# Altium project THREE_PHASE_METER.PrjPCB
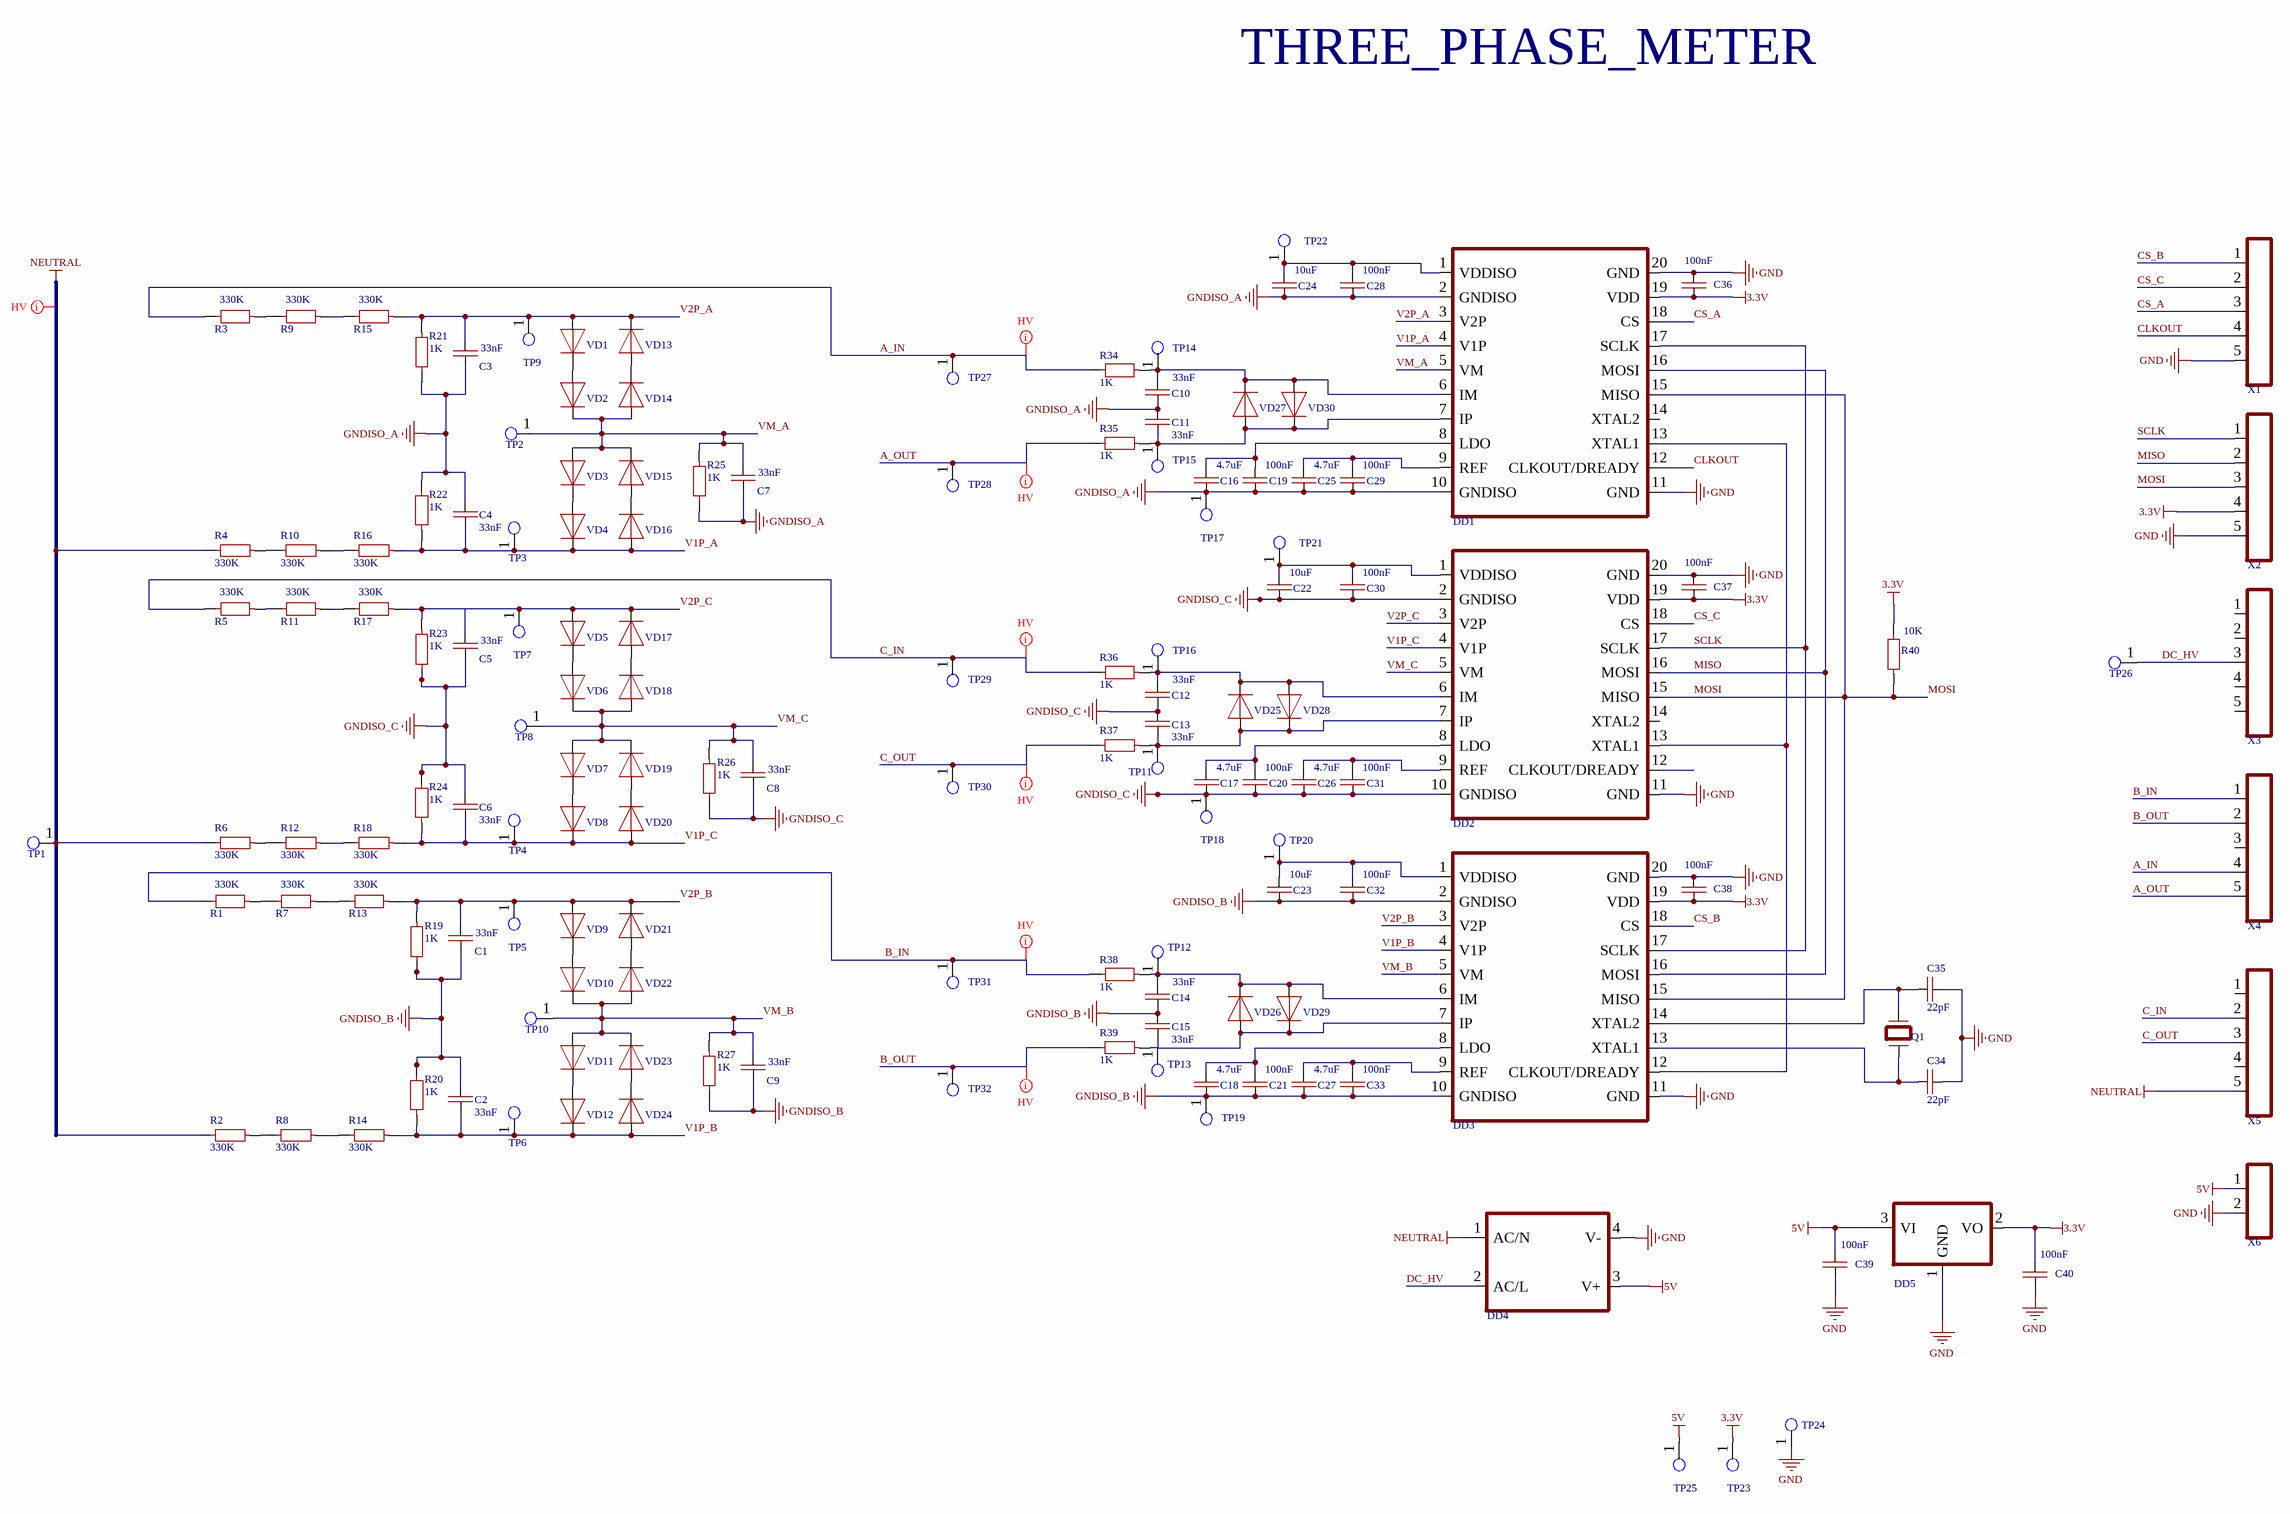
[diagram p0: THREE_PHASE_METER.SchDoc]
1 sheet, 148 parts. Net scope: global (net labels, ports and power ports of the same name join across sheets).
Board file: THREE_PHASE_METER.PcbDoc

## Sheet THREE_PHASE_METER.SchDoc
size A1

### Parts
C1  33nF  [CAP-1206]
C2  33nF  [CAP-1206]
C3  33nF  [CAP-1206]
C4  33nF  [CAP-1206]
C5  33nF  [CAP-1206]
C6  33nF  [CAP-1206]
C7  33nF  [CAP-1206]
C8  33nF  [CAP-1206]
C9  33nF  [CAP-1206]
C10  33nF  [CAP-1206]
C11  33nF  [CAP-1206]
C12  33nF  [CAP-1206]
C13  33nF  [CAP-1206]
C14  33nF  [CAP-1206]
C15  33nF  [CAP-1206]
C16  4.7uF  [CAP-1206]
C17  4.7uF  [CAP-1206]
C18  4.7uF  [CAP-1206]
C19  100nF  [CAP-0603]
C20  100nF  [CAP-0603]
C21  100nF  [CAP-0603]
C22  10uF  [CAP-1206]
C23  10uF  [CAP-1206]
C24  10uF  [CAP-1206]
C25  4.7uF  [CAP-1206]
C26  4.7uF  [CAP-1206]
C27  4.7uF  [CAP-1206]
C28  100nF  [CAP-0603]
C29  100nF  [CAP-0603]
C30  100nF  [CAP-0603]
C31  100nF  [CAP-0603]
C32  100nF  [CAP-0603]
C33  100nF  [CAP-0603]
C34  22pF  [CAP-0603]
C35  22pF  [CAP-0603]
C36  100nF  [CAP-0603]
C37  100nF  [CAP-0603]
C38  100nF  [CAP-0603]
C39  100nF  [CAP-0603]
C40  100nF  [CAP-0603]
DD1  ADE7913  [SOIC20]  (value not drawn)
DD2  ADE7913  [SOIC20]  (value not drawn)
DD3  ADE7913  [SOIC20]  (value not drawn)
DD4  IRM-01  [IRM-01]  (value not drawn)
DD5  AMS1117  [SOT-223-3]  (value not drawn)
Q1  OSC-2-PIN  [OSC-QSMD12.3x4.5x4.2]  (value not drawn)
R1  330K  [RES-1206]
R2  330K  [RES-1206]
R3  330K  [RES-1206]
R4  330K  [RES-1206]
R5  330K  [RES-1206]
R6  330K  [RES-1206]
R7  330K  [RES-1206]
R8  330K  [RES-1206]
R9  330K  [RES-1206]
R10  330K  [RES-1206]
R11  330K  [RES-1206]
R12  330K  [RES-1206]
R13  330K  [RES-1206]
R14  330K  [RES-1206]
R15  330K  [RES-1206]
R16  330K  [RES-1206]
R17  330K  [RES-1206]
R18  330K  [RES-1206]
R19  1K  [RES-1206]
R20  1K  [RES-1206]
R21  1K  [RES-1206]
R22  1K  [RES-1206]
R23  1K  [RES-1206]
R24  1K  [RES-1206]
R25  1K  [RES-1206]
R26  1K  [RES-1206]
R27  1K  [RES-1206]
R34  1K  [RES-1206]
R35  1K  [RES-1206]
R36  1K  [RES-1206]
R37  1K  [RES-1206]
R38  1K  [RES-1206]
R39  1K  [RES-1206]
R40  10K  [RES-0603]
TP1  Test_Point_PCB  [Test_Point]  (value not drawn)
TP2  Test_Point_PCB  [Test_Point]  (value not drawn)
TP3  Test_Point_PCB  [Test_Point]  (value not drawn)
TP4  Test_Point_PCB  [Test_Point]  (value not drawn)
TP5  Test_Point_PCB  [Test_Point]  (value not drawn)
TP6  Test_Point_PCB  [Test_Point]  (value not drawn)
TP7  Test_Point_PCB  [Test_Point]  (value not drawn)
TP8  Test_Point_PCB  [Test_Point]  (value not drawn)
TP9  Test_Point_PCB  [Test_Point]  (value not drawn)
TP10  Test_Point_PCB  [Test_Point]  (value not drawn)
TP11  Test_Point_PCB  [Test_Point]  (value not drawn)
TP12  Test_Point_PCB  [Test_Point]  (value not drawn)
TP13  Test_Point_PCB  [Test_Point]  (value not drawn)
TP14  Test_Point_PCB  [Test_Point]  (value not drawn)
TP15  Test_Point_PCB  [Test_Point]  (value not drawn)
TP16  Test_Point_PCB  [Test_Point]  (value not drawn)
TP17  Test_Point_PCB  [Test_Point]  (value not drawn)
TP18  Test_Point_PCB  [Test_Point]  (value not drawn)
TP19  Test_Point_PCB  [Test_Point]  (value not drawn)
TP20  Test_Point_PCB  [Test_Point]  (value not drawn)
TP21  Test_Point_PCB  [Test_Point]  (value not drawn)
TP22  Test_Point_PCB  [Test_Point]  (value not drawn)
TP23  Test_Point_PCB  [Test_Point]  (value not drawn)
TP24  Test_Point_PCB  [Test_Point]  (value not drawn)
TP25  Test_Point_PCB  [Test_Point]  (value not drawn)
TP26  Test_Point_PCB  [Test_Point]  (value not drawn)
TP27  Test_Point_PCB  [Test_Point]  (value not drawn)
TP28  Test_Point_PCB  [Test_Point]  (value not drawn)
TP29  Test_Point_PCB  [Test_Point]  (value not drawn)
TP30  Test_Point_PCB  [Test_Point]  (value not drawn)
TP31  Test_Point_PCB  [Test_Point]  (value not drawn)
TP32  Test_Point_PCB  [Test_Point]  (value not drawn)
VD1  DIODE  [DIODE-0805]  (value not drawn)
VD2  DIODE  [DIODE-0805]  (value not drawn)
VD3  DIODE  [DIODE-0805]  (value not drawn)
VD4  DIODE  [DIODE-0805]  (value not drawn)
VD5  DIODE  [DIODE-0805]  (value not drawn)
VD6  DIODE  [DIODE-0805]  (value not drawn)
VD7  DIODE  [DIODE-0805]  (value not drawn)
VD8  DIODE  [DIODE-0805]  (value not drawn)
VD9  DIODE  [DIODE-0805]  (value not drawn)
VD10  DIODE  [DIODE-0805]  (value not drawn)
VD11  DIODE  [DIODE-0805]  (value not drawn)
VD12  DIODE  [DIODE-0805]  (value not drawn)
VD13  DIODE  [DIODE-0805]  (value not drawn)
VD14  DIODE  [DIODE-0805]  (value not drawn)
VD15  DIODE  [DIODE-0805]  (value not drawn)
VD16  DIODE  [DIODE-0805]  (value not drawn)
VD17  DIODE  [DIODE-0805]  (value not drawn)
VD18  DIODE  [DIODE-0805]  (value not drawn)
VD19  DIODE  [DIODE-0805]  (value not drawn)
VD20  DIODE  [DIODE-0805]  (value not drawn)
VD21  DIODE  [DIODE-0805]  (value not drawn)
VD22  DIODE  [DIODE-0805]  (value not drawn)
VD23  DIODE  [DIODE-0805]  (value not drawn)
VD24  DIODE  [DIODE-0805]  (value not drawn)
VD25  DIODE  [DIODE-0805]  (value not drawn)
VD26  DIODE  [DIODE-0805]  (value not drawn)
VD27  DIODE  [DIODE-0805]  (value not drawn)
VD28  DIODE  [DIODE-0805]  (value not drawn)
VD29  DIODE  [DIODE-0805]  (value not drawn)
VD30  DIODE  [DIODE-0805]  (value not drawn)
X1  CONN-5-PIN  [CONN-PLS-5-2.54mm]  (value not drawn)
X2  CONN-5-PIN  [CONN-PLS-5-2.54mm]  (value not drawn)
X3  CONN-5-PIN  [CONN-PLS-5-2.54mm]  (value not drawn)
X4  CONN-5-PIN  [CONN-PLS-5-2.54mm]  (value not drawn)
X5  CONN-5-PIN  [CONN-PLS-5-2.54mm]  (value not drawn)
X6  CONN-2-PIN  [CONN-PLS-2-2.54mm]  (value not drawn)

### Nets
3.3V: C36.1 C37.1 C38.1 C40.2 DD1.19(VDD) DD2.19(VDD) DD3.19(VDD) DD5.2(VO) R40.2 TP23.1(G9) X2.4
5V: C39.2 DD4.3(V+) DD5.3(VI) TP25.1(G9) X6.1
GND: C34.1 C35.1 C36.2 C37.2 C38.2 C39.1 C40.1 DD1.11(GND) DD1.20(GND) DD2.11(GND) DD2.20(GND) DD3.11(GND) DD3.20(GND) DD4.4(V-) DD5.1(GND) TP24.1(G9) X1.5 X2.5 X6.2
GNDISO_A: C3.1 C4.1 C7.1 C10.1 C11.1 C16.1 C19.1 C24.1 C25.1 C28.1 C29.1 DD1.2(GNDISO) DD1.10(GNDISO) R21.2 R22.2 R25.2 TP17.1(G9)
GNDISO_B: C1.1 C2.1 C9.1 C14.1 C15.1 C18.1 C21.1 C23.1 C27.1 C32.1 C33.1 DD3.2(GNDISO) DD3.10(GNDISO) R19.2 R20.2 R27.2 TP19.1(G9)
GNDISO_C: C5.1 C6.1 C8.1 C12.1 C13.1 C17.1 C20.1 C22.1 C26.1 C30.1 C31.1 DD2.2(GNDISO) DD2.10(GNDISO) R23.2 R24.2 R26.2 TP18.1(G9)
NEUTRAL: DD4.1(AC/N) R2.2 R4.2 R6.2 TP1.1(G9) X5.5
A_IN: R3.2 R34.2 TP27.1(G9) X4.4
A_OUT: R35.2 TP28.1(G9) X4.5
B_IN: R1.2 R38.2 TP31.1(G9) X4.1
B_OUT: R39.2 TP32.1(G9) X4.2
C_IN: R5.2 R36.2 TP29.1(G9) X5.2
C_OUT: R37.2 TP30.1(G9) X5.3
CLKOUT: DD1.12(CLKOUT/DREADY) X1.4
CS_A: DD1.18(CS) X1.3
CS_B: DD3.18(CS) X1.1
CS_C: DD2.18(CS) X1.2
DC_HV: DD4.2(AC/L) TP26.1(G9) X3.3
MISO: DD1.16(MOSI) DD2.16(MOSI) DD3.16(MOSI) X2.2
MOSI: DD1.15(MISO) DD2.15(MISO) DD3.15(MISO) R40.1 X2.3
SCLK: DD1.17(SCLK) DD2.17(SCLK) DD3.17(SCLK) X2.1
V1P_A: C4.2 DD1.4(V1P) R16.1 R22.1 TP3.1(G9) VD4.1(C) VD16.2(A)
V1P_B: C2.2 DD3.4(V1P) R14.1 R20.1 TP6.1(G9) VD12.1(C) VD24.2(A)
V1P_C: C6.2 DD2.4(V1P) R18.1 R24.1 TP4.1(G9) VD8.1(C) VD20.2(A)
V2P_A: C3.2 DD1.3(V2P) R15.1 R21.1 TP9.1(G9) VD1.2(A) VD13.1(C)
V2P_B: C1.2 DD3.3(V2P) R13.1 R19.1 TP5.1(G9) VD9.2(A) VD21.1(C)
V2P_C: C5.2 DD2.3(V2P) R17.1 R23.1 TP7.1(G9) VD5.2(A) VD17.1(C)
VM_A: C7.2 DD1.5(VM) R25.1 TP2.1(G9) VD2.1(C) VD3.2(A) VD14.2(A) VD15.1(C)
VM_B: C9.2 DD3.5(VM) R27.1 TP10.1(G9) VD10.1(C) VD11.2(A) VD22.2(A) VD23.1(C)
VM_C: C8.2 DD2.5(VM) R26.1 TP8.1(G9) VD6.1(C) VD7.2(A) VD18.2(A) VD19.1(C)
NetC10_2: C10.2 DD1.6(IM) R34.1 TP14.1(G9) VD27.1(C) VD30.2(A)
NetC11_2: C11.2 DD1.7(IP) R35.1 TP15.1(G9) VD27.2(A) VD30.1(C)
NetC12_2: C12.2 DD2.6(IM) R36.1 TP16.1(G9) VD25.1(C) VD28.2(A)
NetC13_2: C13.2 DD2.7(IP) R37.1 TP11.1(G9) VD25.2(A) VD28.1(C)
NetC14_2: C14.2 DD3.6(IM) R38.1 TP12.1(G9) VD26.1(C) VD29.2(A)
NetC15_2: C15.2 DD3.7(IP) R39.1 TP13.1(G9) VD26.2(A) VD29.1(C)
NetC16_2: C16.2 C19.2 DD1.8(LDO)
NetC17_2: C17.2 C20.2 DD2.8(LDO)
NetC18_2: C18.2 C21.2 DD3.8(LDO)
NetC22_2: C22.2 C30.2 DD2.1(VDDISO) TP21.1(G9)
NetC23_2: C23.2 C32.2 DD3.1(VDDISO) TP20.1(G9)
NetC24_2: C24.2 C28.2 DD1.1(VDDISO) TP22.1(G9)
NetC25_2: C25.2 C29.2 DD1.9(REF)
NetC26_2: C26.2 C31.2 DD2.9(REF)
NetC27_2: C27.2 C33.2 DD3.9(REF)
NetC34_2: C34.2 DD3.13(XTAL1) Q1.1
NetC35_2: C35.2 DD3.14(XTAL2) Q1.2
NetDD1_13: DD1.13(XTAL1) DD2.13(XTAL1) DD3.12(CLKOUT/DREADY)
NetR1_1: R1.1 R7.2
NetR2_1: R2.1 R8.2
NetR3_1: R3.1 R9.2
NetR4_1: R4.1 R10.2
NetR5_1: R5.1 R11.2
NetR6_1: R6.1 R12.2
NetR7_1: R7.1 R13.2
NetR8_1: R8.1 R14.2
NetR9_1: R9.1 R15.2
NetR10_1: R10.1 R16.2
NetR11_1: R11.1 R17.2
NetR12_1: R12.1 R18.2
NetVD1_1: VD1.1(C) VD2.2(A)
NetVD3_1: VD3.1(C) VD4.2(A)
NetVD5_1: VD5.1(C) VD6.2(A)
NetVD7_1: VD7.1(C) VD8.2(A)
NetVD9_1: VD9.1(C) VD10.2(A)
NetVD11_1: VD11.1(C) VD12.2(A)
NetVD13_2: VD13.2(A) VD14.1(C)
NetVD15_2: VD15.2(A) VD16.1(C)
NetVD17_2: VD17.2(A) VD18.1(C)
NetVD19_2: VD19.2(A) VD20.1(C)
NetVD21_2: VD21.2(A) VD22.1(C)
NetVD23_2: VD23.2(A) VD24.1(C)

Not connected (* = marked no-connect by the designer): DD1 14(XTAL2); DD2 12(CLKOUT/DREADY) 14(XTAL2); X3 1 2 4 5; X4 3; X5 1 4

### Layout directives
mark named HV: A_IN, A_OUT, B_IN, B_OUT, C_IN, C_OUT, NEUTRAL

### Notes on the sheet
- THREE_PHASE_METER

### Library data of the parts
C1-C40 = CAP-NON-POLAR
R1-R27 R34-R40 = RES-CONST
TP1-TP32 = TP_PCB?: Test_Point